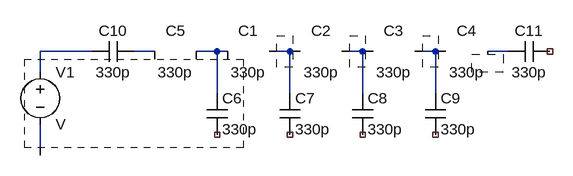
[diagram p0: schematic Draft2.asc]
Draft2.asc, the LTspice schematic file:
Version 4
SHEET 1 880 680
WIRE -128 96 -208 96
WIRE -32 96 -64 96
WIRE 64 96 32 96
WIRE 80 96 64 96
WIRE 176 96 144 96
WIRE 192 96 176 96
WIRE 288 96 256 96
WIRE 304 96 288 96
WIRE 400 96 368 96
WIRE 416 96 400 96
WIRE 512 96 480 96
WIRE -208 128 -208 96
WIRE 64 160 64 96
WIRE 176 160 176 96
WIRE 288 160 288 96
WIRE 400 160 400 96
WIRE -208 256 -208 208
SYMBOL Misc\\xtal 144 80 R90
WINDOW 0 0 32 VBottom 2
WINDOW 3 32 32 VTop 2
SYMATTR InstName C1
SYMATTR Value 330p
SYMBOL Misc\\xtal 256 80 R90
WINDOW 0 0 32 VBottom 2
WINDOW 3 32 32 VTop 2
SYMATTR InstName C2
SYMATTR Value 330p
SYMBOL Misc\\xtal 368 80 R90
WINDOW 0 0 32 VBottom 2
WINDOW 3 32 32 VTop 2
SYMATTR InstName C3
SYMATTR Value 330p
SYMBOL Misc\\xtal 480 80 R90
WINDOW 0 0 32 VBottom 2
WINDOW 3 32 32 VTop 2
SYMATTR InstName C4
SYMATTR Value 330p
SYMBOL Misc\\xtal 32 80 R90
WINDOW 0 0 32 VBottom 2
WINDOW 3 32 32 VTop 2
SYMATTR InstName C5
SYMATTR Value 330p
SYMBOL cap 48 160 R0
SYMATTR InstName C6
SYMATTR Value 330p
SYMBOL cap 160 160 R0
SYMATTR InstName C7
SYMATTR Value 330p
SYMBOL cap 272 160 R0
SYMATTR InstName C8
SYMATTR Value 330p
SYMBOL cap 384 160 R0
SYMATTR InstName C9
SYMATTR Value 330p
SYMBOL cap -64 80 R90
WINDOW 0 0 32 VBottom 2
WINDOW 3 32 32 VTop 2
SYMATTR InstName C10
SYMATTR Value 330p
SYMBOL cap 576 80 R90
WINDOW 0 0 32 VBottom 2
WINDOW 3 32 32 VTop 2
SYMATTR InstName C11
SYMATTR Value 330p
SYMBOL voltage -208 112 R0
SYMATTR InstName V1

The netlist it stands for:
* Draft2.asc
* C1: 330p (symbol Misc\xtal not available, pin order unknown); nets seen at it: N004
* C2: 330p (symbol Misc\xtal not available, pin order unknown); nets seen at it: N005
* C3: 330p (symbol Misc\xtal not available, pin order unknown); nets seen at it: N006
* C4: 330p (symbol Misc\xtal not available, pin order unknown); nets seen at it: N007
* C5: 330p (symbol Misc\xtal not available, pin order unknown); nets seen at it: N002, N003, N008
C6 N003 NC_01 330p
C7 N004 NC_02 330p
C8 N005 NC_03 330p
C9 N006 NC_04 330p
C10 N002 N001 330p
C11 NC_05 N007 330p
V1 N001 N008 V
.backanno
.end